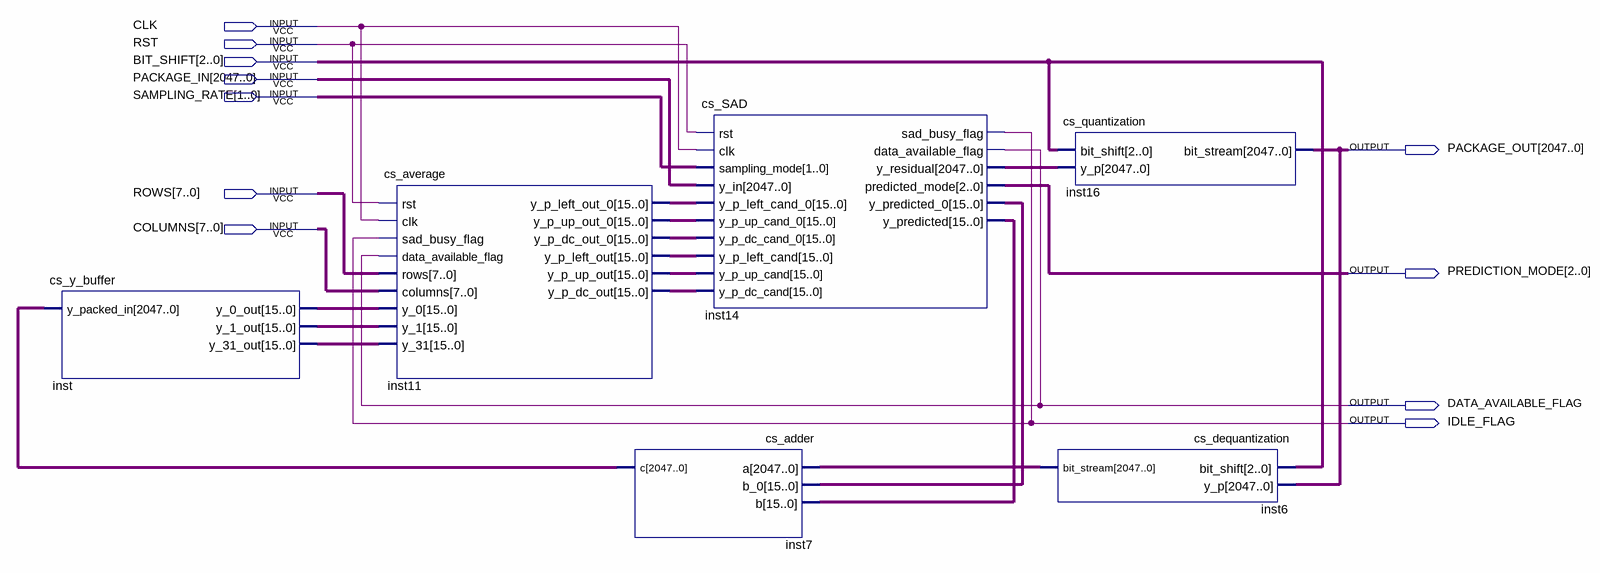
[diagram p0: schematic sheet]
// Quartus schematic compressed_sensing_walsh_ifwht_intra_prediction.bdf as structural Verilog: 6 symbols, 11 pins
module compressed_sensing_walsh_ifwht_intra_prediction (
  input  CLK,
  input  RST,
  input  [2:0] BIT_SHIFT,
  input  [2047:0] PACKAGE_IN,
  input  [1:0] SAMPLING_RATE,
  input  [7:0] ROWS,
  input  [7:0] COLUMNS,
  output [2047:0] PACKAGE_OUT,
  output [2:0] PREDICTION_MODE,
  output DATA_AVAILABLE_FLAG,
  output IDLE_FLAG
);

  wire [15:0] inst11_y_p_dc_out, inst11_y_p_dc_out_0, inst11_y_p_left_out, inst11_y_p_left_out_0,
       inst11_y_p_up_out, inst11_y_p_up_out_0, inst14_y_predicted, inst14_y_predicted_0, inst_y_0_out,
       inst_y_1_out, inst_y_31_out;
  wire [2047:0] inst6_bit_stream, inst7_c, inst14_y_residual;

  cs_y_buffer inst (.y_packed_in(inst7_c), .y_0_out(inst_y_0_out), .y_1_out(inst_y_1_out), .y_31_out(inst_y_31_out));
  cs_average inst11 (
    .rst(RST), .clk(CLK), .sad_busy_flag(IDLE_FLAG), .data_available_flag(DATA_AVAILABLE_FLAG), .rows(ROWS),
    .columns(COLUMNS), .y_0(inst_y_0_out), .y_1(inst_y_1_out), .y_31(inst_y_31_out),
    .y_p_left_out_0(inst11_y_p_left_out_0), .y_p_up_out_0(inst11_y_p_up_out_0),
    .y_p_dc_out_0(inst11_y_p_dc_out_0), .y_p_left_out(inst11_y_p_left_out), .y_p_up_out(inst11_y_p_up_out),
    .y_p_dc_out(inst11_y_p_dc_out));
  cs_adder inst7 (.a(inst6_bit_stream), .b_0(inst14_y_predicted_0), .b(inst14_y_predicted), .c(inst7_c));
  cs_SAD inst14 (
    .rst(RST), .clk(CLK), .sampling_mode(SAMPLING_RATE), .y_in(PACKAGE_IN),
    .y_p_left_cand_0(inst11_y_p_left_out_0), .y_p_up_cand_0(inst11_y_p_up_out_0),
    .y_p_dc_cand_0(inst11_y_p_dc_out_0), .y_p_left_cand(inst11_y_p_left_out),
    .y_p_up_cand(inst11_y_p_up_out), .y_p_dc_cand(inst11_y_p_dc_out), .sad_busy_flag(IDLE_FLAG),
    .data_available_flag(DATA_AVAILABLE_FLAG), .y_residual(inst14_y_residual),
    .predicted_mode(PREDICTION_MODE), .y_predicted_0(inst14_y_predicted_0), .y_predicted(inst14_y_predicted));
  cs_dequantization inst6 (.bit_shift(BIT_SHIFT), .y_p(PACKAGE_OUT), .bit_stream(inst6_bit_stream));
  cs_quantization inst16 (.bit_shift(BIT_SHIFT), .y_p(inst14_y_residual), .bit_stream(PACKAGE_OUT));
endmodule
